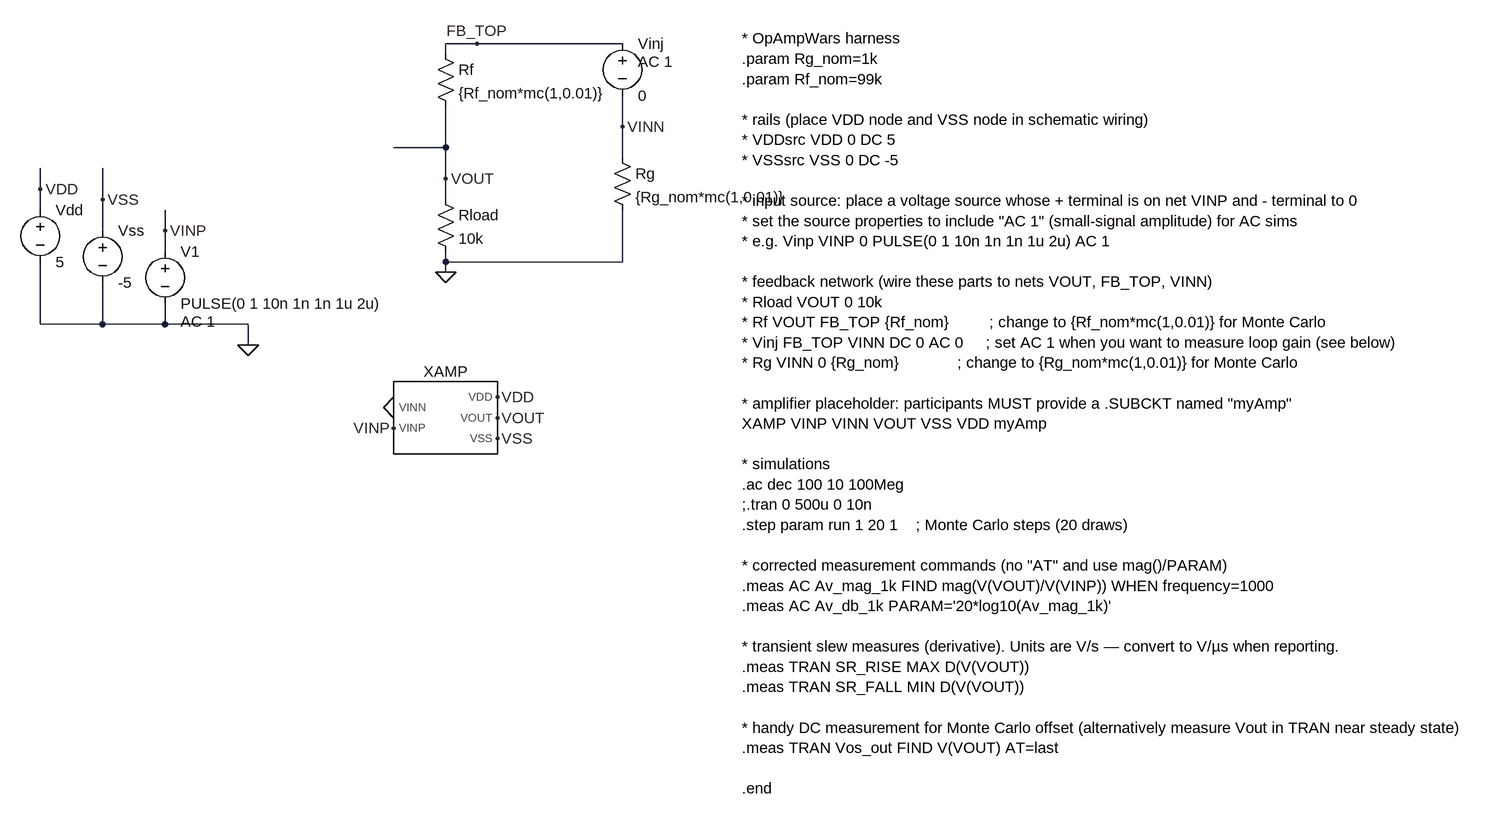
[diagram p0: schematic saishree.asc]
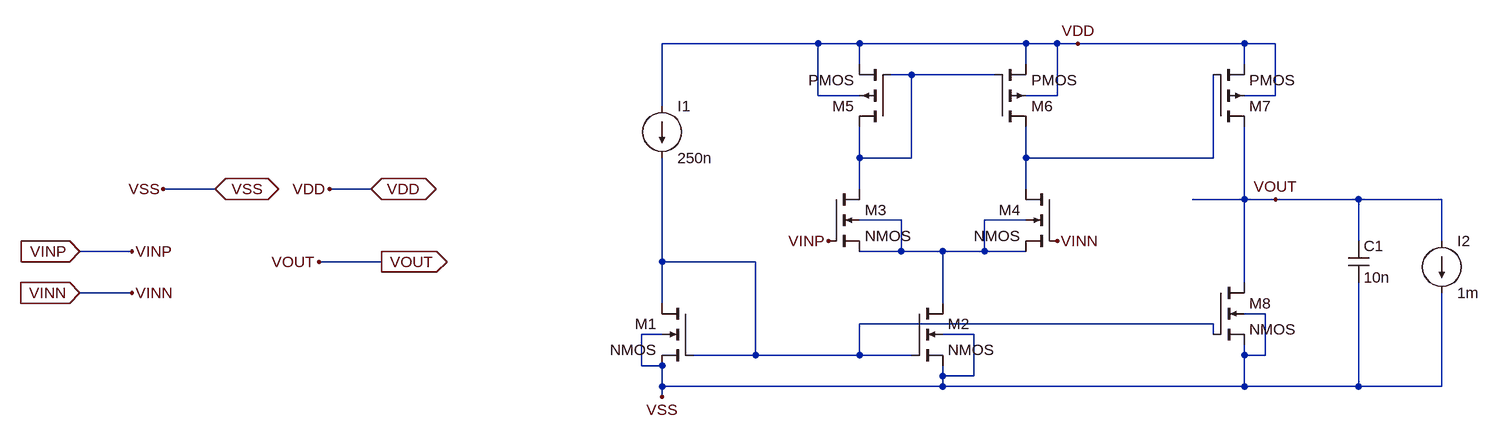
[diagram p1: sub-circuit myamp.asc]
saishree.asc, the LTspice schematic file:
Version 4
SHEET 1 3004 2024
WIRE 576 -240 528 -240
WIRE 800 -240 576 -240
WIRE 528 -224 528 -240
WIRE 800 -112 800 -160
WIRE 528 -80 528 -144
WIRE 528 -80 448 -80
WIRE 800 -64 800 -112
WIRE 528 -32 528 -80
WIRE -96 -16 -96 -48
WIRE 0 0 0 -48
WIRE 528 0 528 -32
WIRE -96 16 -96 -16
WIRE 0 48 0 0
WIRE 96 48 96 16
WIRE 96 80 96 48
WIRE 528 96 528 80
WIRE 800 96 800 16
WIRE 800 96 528 96
WIRE 528 112 528 96
WIRE -96 192 -96 96
WIRE 0 192 0 128
WIRE 0 192 -96 192
WIRE 96 192 96 160
WIRE 96 192 0 192
WIRE 224 192 96 192
WIRE 224 224 224 192
FLAG 224 224 0
FLAG -96 -16 VDD
FLAG 0 0 VSS
FLAG 96 48 VINP
FLAG 528 112 0
FLAG 528 -32 VOUT
FLAG 576 -240 FB_TOP
FLAG 800 -112 VINN
FLAG 448 352 VINP
FLAG 608 304 VDD
FLAG 608 336 VOUT
FLAG 608 368 VSS
FLAG 448 320 0
SYMBOL voltage 96 64 R0
WINDOW 123 24 124 Left 2
WINDOW 39 0 0 Left 0
SYMATTR Value2 AC 1
SYMATTR InstName V1
SYMATTR Value PULSE(0 1 10n 1n 1n 1u 2u)
SYMBOL voltage 0 32 R0
WINDOW 123 0 0 Left 0
WINDOW 39 0 0 Left 0
SYMATTR InstName Vss
SYMATTR Value -5
SYMBOL voltage -96 0 R0
WINDOW 123 0 0 Left 0
WINDOW 39 0 0 Left 0
SYMATTR InstName Vdd
SYMATTR Value 5
SYMBOL res 512 -240 R0
SYMATTR InstName Rf
SYMATTR Value {Rf_nom*mc(1,0.01)}
SYMBOL res 784 -80 R0
SYMATTR InstName Rg
SYMATTR Value {Rg_nom*mc(1,0.01)}
SYMBOL res 512 -16 R0
SYMATTR InstName Rload
SYMATTR Value 10k
SYMBOL voltage 800 -256 R0
WINDOW 123 24 44 Left 2
WINDOW 39 0 0 Left 0
SYMATTR Value2 AC 1
SYMATTR InstName Vinj
SYMATTR Value 0
SYMBOL myAmp 528 336 R0
SYMATTR InstName XAMP
TEXT 984 -248 Left 2 !* OpAmpWars harness\n.param Rg_nom=1k\n.param Rf_nom=99k\n \n* rails (place VDD node and VSS node in schematic wiring)\n* VDDsrc VDD 0 DC 5\n* VSSsrc VSS 0 DC -5\n \n* input source: place a voltage source whose + terminal is on net VINP and - terminal to 0\n* set the source properties to include "AC 1" (small-signal amplitude) for AC sims\n* e.g. Vinp VINP 0 PULSE(0 1 10n 1n 1n 1u 2u) AC 1\n \n* feedback network (wire these parts to nets VOUT, FB_TOP, VINN)\n* Rload VOUT 0 10k\n* Rf VOUT FB_TOP {Rf_nom}         ; change to {Rf_nom*mc(1,0.01)} for Monte Carlo\n* Vinj FB_TOP VINN DC 0 AC 0     ; set AC 1 when you want to measure loop gain (see below)\n* Rg VINN 0 {Rg_nom}             ; change to {Rg_nom*mc(1,0.01)} for Monte Carlo\n \n* amplifier placeholder: participants MUST provide a .SUBCKT named "myAmp"\nXAMP VINP VINN VOUT VSS VDD myAmp\n \n* simulations\n.ac dec 100 10 100Meg\n;.tran 0 500u 0 10n\n.step param run 1 20 1    ; Monte Carlo steps (20 draws)\n \n* corrected measurement commands (no "AT" and use mag()/PARAM)\n.meas AC Av_mag_1k FIND mag(V(VOUT)/V(VINP)) WHEN frequency=1000\n.meas AC Av_db_1k PARAM='20*log10(Av_mag_1k)'\n \n* transient slew measures (derivative). Units are V/s — convert to V/µs when reporting.\n.meas TRAN SR_RISE MAX D(V(VOUT))\n.meas TRAN SR_FALL MIN D(V(VOUT))\n \n* handy DC measurement for Monte Carlo offset (alternatively measure Vout in TRAN near steady state)\n.meas TRAN Vos_out FIND V(VOUT) AT=last\n \n.end

myamp.asc, the sub-circuit schematic file:
Version 4
SHEET 1 1444 680
WIRE 400 -592 160 -592
WIRE 464 -592 400 -592
WIRE 720 -592 464 -592
WIRE 768 -592 720 -592
WIRE 800 -592 768 -592
WIRE 1056 -592 800 -592
WIRE 1104 -592 1056 -592
WIRE 464 -560 464 -592
WIRE 720 -560 720 -592
WIRE 1056 -560 1056 -592
WIRE 544 -544 512 -544
WIRE 672 -544 544 -544
WIRE 400 -512 400 -592
WIRE 464 -512 400 -512
WIRE 768 -512 768 -592
WIRE 768 -512 720 -512
WIRE 1104 -512 1104 -592
WIRE 1104 -512 1056 -512
WIRE 160 -496 160 -592
WIRE 464 -416 464 -464
WIRE 544 -416 544 -544
WIRE 544 -416 464 -416
WIRE 720 -416 720 -464
WIRE 1008 -416 1008 -544
WIRE 1008 -416 720 -416
WIRE -528 -368 -608 -368
WIRE -288 -368 -352 -368
WIRE 464 -368 464 -416
WIRE 720 -368 720 -416
WIRE 1056 -352 1056 -464
WIRE 1056 -352 976 -352
WIRE 1104 -352 1056 -352
WIRE 1232 -352 1104 -352
WIRE 1360 -352 1232 -352
WIRE 528 -320 464 -320
WIRE 720 -320 656 -320
WIRE 1232 -288 1232 -352
WIRE 1360 -288 1360 -352
WIRE -656 -272 -736 -272
WIRE 528 -272 528 -320
WIRE 528 -272 464 -272
WIRE 592 -272 528 -272
WIRE 656 -272 656 -320
WIRE 656 -272 592 -272
WIRE 720 -272 656 -272
WIRE -272 -256 -368 -256
WIRE 160 -256 160 -416
WIRE 304 -256 160 -256
WIRE 1056 -224 1056 -352
WIRE -656 -208 -736 -208
WIRE 160 -192 160 -256
WIRE 592 -192 592 -272
WIRE 1088 -176 1056 -176
WIRE 1008 -160 464 -160
WIRE 160 -144 128 -144
WIRE 640 -144 592 -144
WIRE 1008 -144 1008 -160
WIRE 304 -112 304 -256
WIRE 304 -112 208 -112
WIRE 464 -112 464 -160
WIRE 464 -112 304 -112
WIRE 544 -112 464 -112
WIRE 1056 -112 1056 -128
WIRE 1088 -112 1088 -176
WIRE 1088 -112 1056 -112
WIRE 128 -96 128 -144
WIRE 160 -96 128 -96
WIRE 592 -80 592 -96
WIRE 640 -80 640 -144
WIRE 640 -80 592 -80
WIRE 160 -64 160 -96
WIRE 592 -64 592 -80
WIRE 592 -64 160 -64
WIRE 1056 -64 1056 -112
WIRE 1056 -64 592 -64
WIRE 1232 -64 1232 -224
WIRE 1232 -64 1056 -64
WIRE 1360 -64 1360 -208
WIRE 1360 -64 1232 -64
WIRE 160 -48 160 -64
FLAG -736 -272 VINP
IOPIN -736 -272 In
FLAG -272 -256 VOUT
IOPIN -272 -256 Out
FLAG -736 -208 VINN
IOPIN -736 -208 In
FLAG -288 -368 VDD
IOPIN -288 -368 BiDir
FLAG -528 -368 VSS
IOPIN -528 -368 BiDir
FLAG -656 -208 VINN
FLAG -656 -272 VINP
FLAG -368 -256 VOUT
FLAG -352 -368 VDD
FLAG -608 -368 VSS
FLAG 160 -48 VSS
FLAG 416 -288 VINP
FLAG 768 -288 VINN
FLAG 800 -592 VDD
FLAG 1104 -352 VOUT
SYMBOL current 160 -496 R0
SYMATTR InstName I1
SYMATTR Value 250n
SYMBOL nmos4 208 -192 M0
SYMATTR InstName M1
SYMATTR Value2 l=1.260u w=.360u
SYMBOL nmos4 544 -192 R0
SYMATTR InstName M2
SYMATTR Value2 l=1.260u w=.360u
SYMBOL nmos4 416 -368 R0
SYMATTR InstName M3
SYMATTR Value2 l=.360u w=.360u
SYMBOL nmos4 768 -368 M0
SYMATTR InstName M4
SYMATTR Value2 l=.360u w=.360u
SYMBOL pmos4 512 -464 R180
SYMATTR InstName M5
SYMATTR Value2 l=.720u w=.360u
SYMBOL pmos4 672 -464 M180
SYMATTR InstName M6
SYMATTR Value2 l=.720u w=.360u
SYMBOL nmos4 1008 -224 R0
SYMATTR InstName M8
SYMATTR Value2 l=1.260u w=.360u
SYMBOL cap 1216 -288 R0
SYMATTR InstName C1
SYMATTR Value 10n
SYMBOL pmos4 1008 -464 M180
SYMATTR InstName M7
SYMATTR Value2 l=.180u w=.1000u
SYMBOL current 1360 -288 R0
SYMATTR InstName I2
SYMATTR Value 1m

The netlist it stands for:
* saishree.asc
V1 VINP 0 PULSE(0 1 10n 1n 1n 1u 2u) AC 1
Vss VSS 0 -5
Vdd VDD 0 5
Rf FB_TOP VOUT {Rf_nom*mc(1,0.01)}
Rg VINN 0 {Rg_nom*mc(1,0.01)}
Rload VOUT 0 10k
Vinj FB_TOP VINN 0 AC 1
XXAMP 0 VINP VDD VOUT VSS myamp

* block symbol definitions
.subckt myamp VINN VINP VDD VOUT VSS
I1 VDD N004 250n
M1 N004 N004 VSS VSS NMOS l=1.260u w=.360u
M2 N003 N004 VSS VSS NMOS l=1.260u w=.360u
M3 N001 VINP N003 N003 NMOS l=.360u w=.360u
M4 N002 VINN N003 N003 NMOS l=.360u w=.360u
M5 N001 N001 VDD VDD PMOS l=.720u w=.360u
M6 N002 N001 VDD VDD PMOS l=.720u w=.360u
M8 VOUT N004 VSS VSS NMOS l=1.260u w=.360u
C1 VOUT VSS 10n
M7 VOUT N002 VDD VDD PMOS l=.180u w=.1000u
I2 VOUT VSS 1m
.ends myamp

.model NMOS NMOS
.model PMOS PMOS
.lib standard.mos
* OpAmpWars harness
.param Rg_nom=1k
.param Rf_nom=99k
* rails (place VDD node and VSS node in schematic wiring)
* VDDsrc VDD 0 DC 5
* VSSsrc VSS 0 DC -5
* input source: place a voltage source whose + terminal is on net VINP and - terminal to 0
* set the source properties to include "AC 1" (small-signal amplitude) for AC sims
* e.g. Vinp VINP 0 PULSE(0 1 10n 1n 1n 1u 2u) AC 1
* feedback network (wire these parts to nets VOUT, FB_TOP, VINN)
* Rload VOUT 0 10k
* Rf VOUT FB_TOP {Rf_nom}         ; change to {Rf_nom*mc(1,0.01)} for Monte Carlo
* Vinj FB_TOP VINN DC 0 AC 0     ; set AC 1 when you want to measure loop gain (see below)
* Rg VINN 0 {Rg_nom}             ; change to {Rg_nom*mc(1,0.01)} for Monte Carlo
* amplifier placeholder: participants MUST provide a .SUBCKT named "myAmp"
XAMP VINP VINN VOUT VSS VDD myAmp
* simulations
.ac dec 100 10 100Meg
;.tran 0 500u 0 10n
.step param run 1 20 1    ; Monte Carlo steps (20 draws)
* corrected measurement commands (no "AT" and use mag()/PARAM)
.meas AC Av_mag_1k FIND mag(V(VOUT)/V(VINP)) WHEN frequency=1000
.meas AC Av_db_1k PARAM='20*log10(Av_mag_1k)'
* transient slew measures (derivative). Units are V/s — convert to V/µs when reporting.
.meas TRAN SR_RISE MAX D(V(VOUT))
.meas TRAN SR_FALL MIN D(V(VOUT))
* handy DC measurement for Monte Carlo offset (alternatively measure Vout in TRAN near steady state)
.meas TRAN Vos_out FIND V(VOUT) AT=last
.end
.backanno
.end